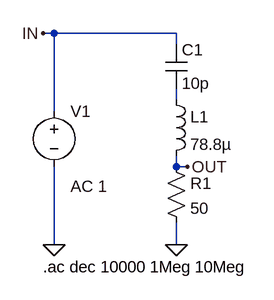
[diagram p0: schematic zad2_lista5.asc]
zad2_lista5.asc, the LTspice schematic file:
Version 4.1
SHEET 1 880 680
WIRE 96 16 80 16
WIRE 272 16 96 16
WIRE 272 32 272 16
WIRE 272 112 272 96
WIRE 96 128 96 16
WIRE 272 208 272 192
WIRE 288 208 272 208
WIRE 96 320 96 208
WIRE 272 320 272 288
FLAG 272 320 0
FLAG 96 320 0
FLAG 288 208 OUT
FLAG 80 16 IN
SYMBOL voltage 96 112 R0
WINDOW 123 24 124 Left 2
WINDOW 39 0 0 Left 0
SYMATTR InstName V1
SYMATTR Value ""
SYMATTR Value2 AC 1
SYMBOL cap 256 32 R0
SYMATTR InstName C1
SYMATTR Value 10p
SYMBOL ind 256 96 R0
SYMATTR InstName L1
SYMATTR Value 78.8µ
SYMBOL res 256 192 R0
SYMATTR InstName R1
SYMATTR Value 50
TEXT 80 352 Left 2 !.ac dec 10000 1Meg 10Meg

The netlist it stands for:
* zad2_lista5.asc
V1 IN 0 AC 1
C1 IN N001 10p
L1 N001 OUT 78.8µ
R1 OUT 0 50
.ac dec 10000 1Meg 10Meg
.backanno
.end